# EAGLE board isolator_v2 (EAGLE 5.12), part 1 of 2
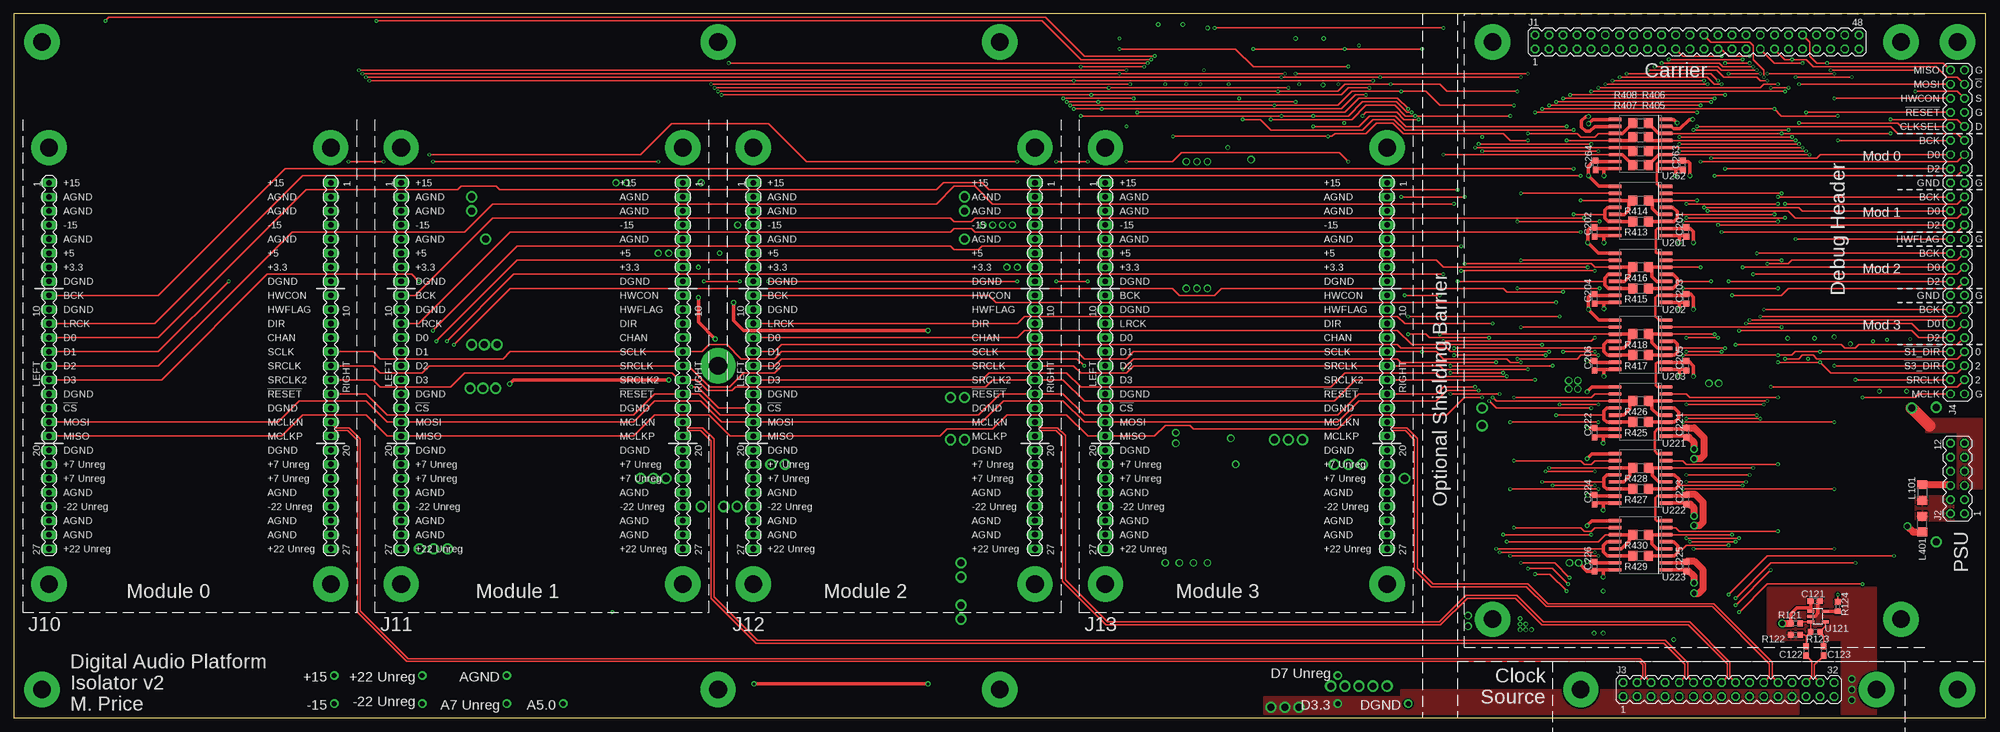
[diagram p7: board, top side]
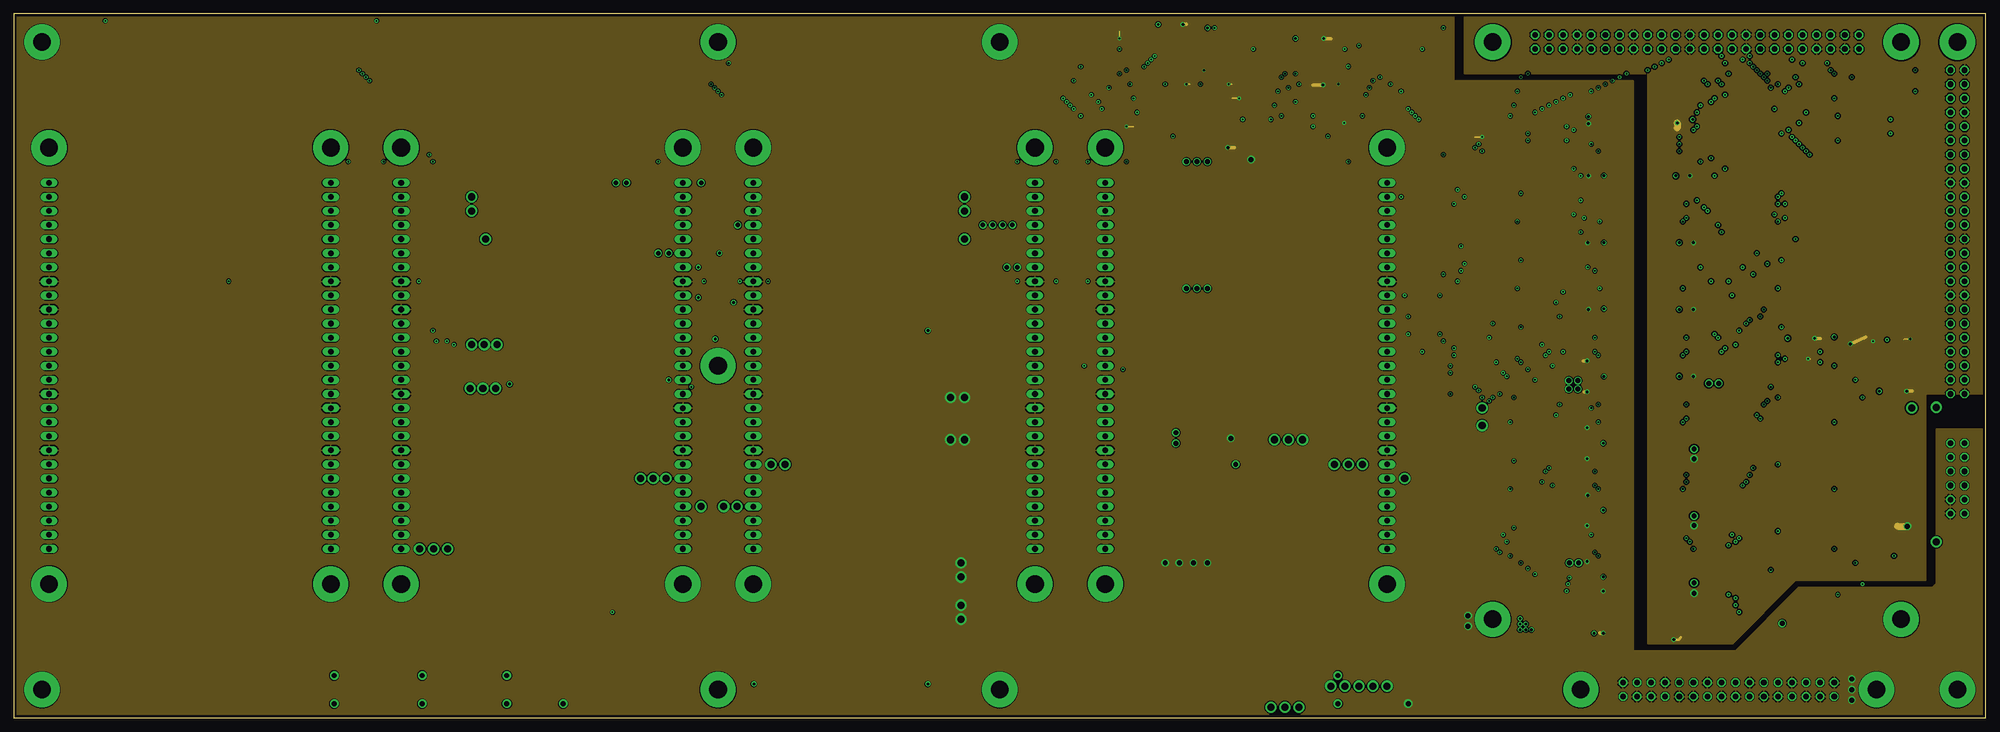
[diagram p8: board, inner layer Route2]
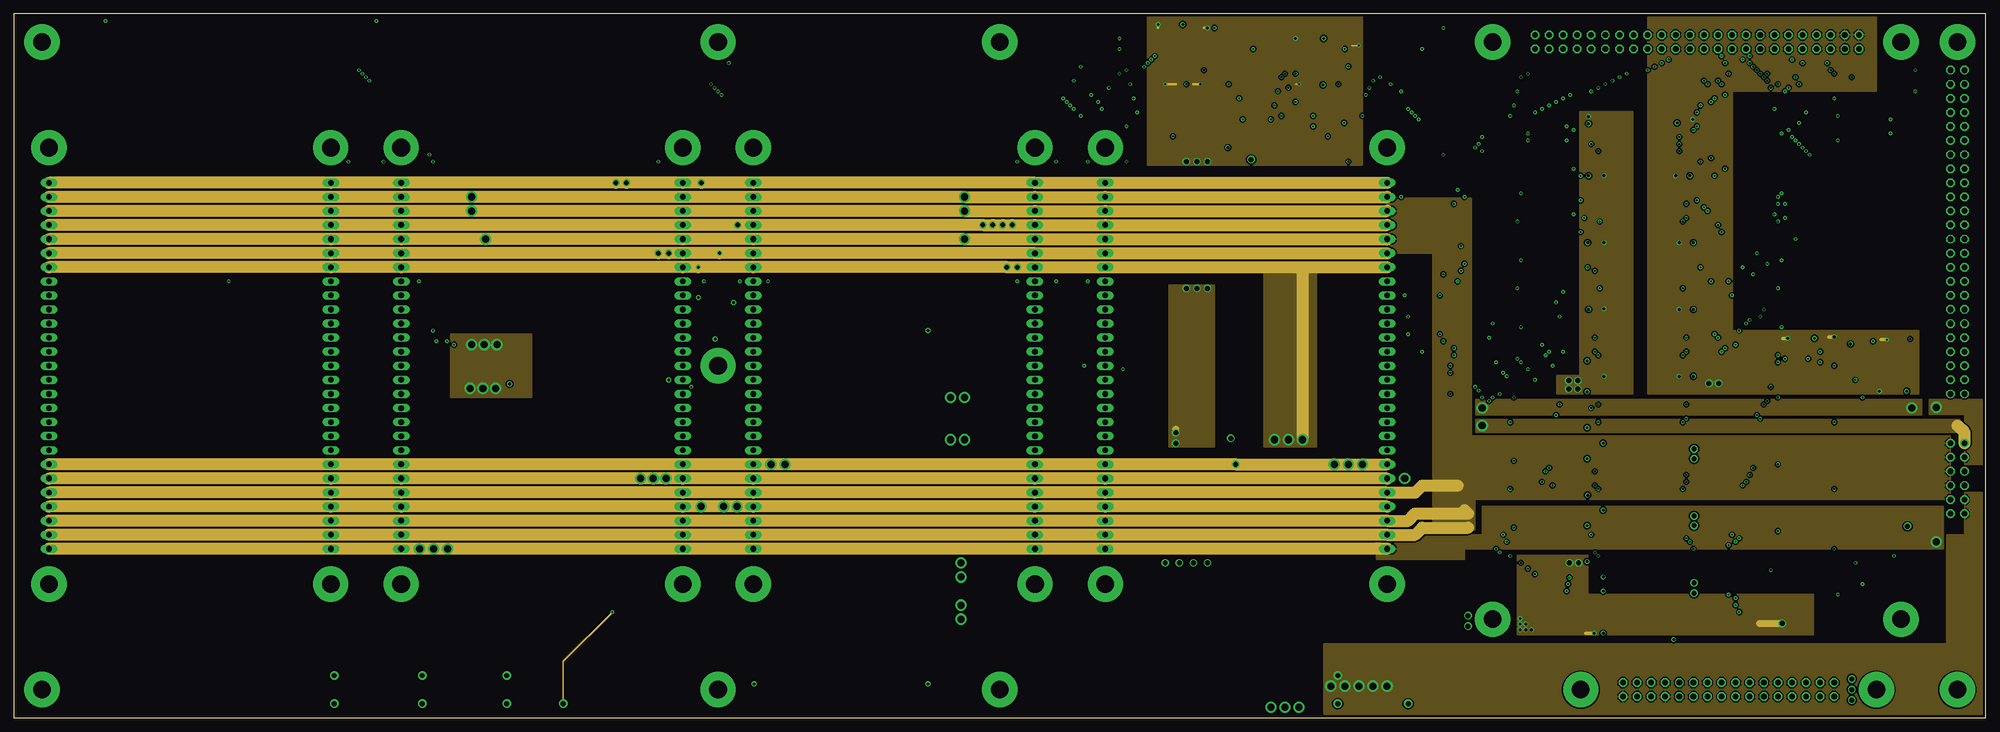
[diagram p9: board, inner layer Route15]
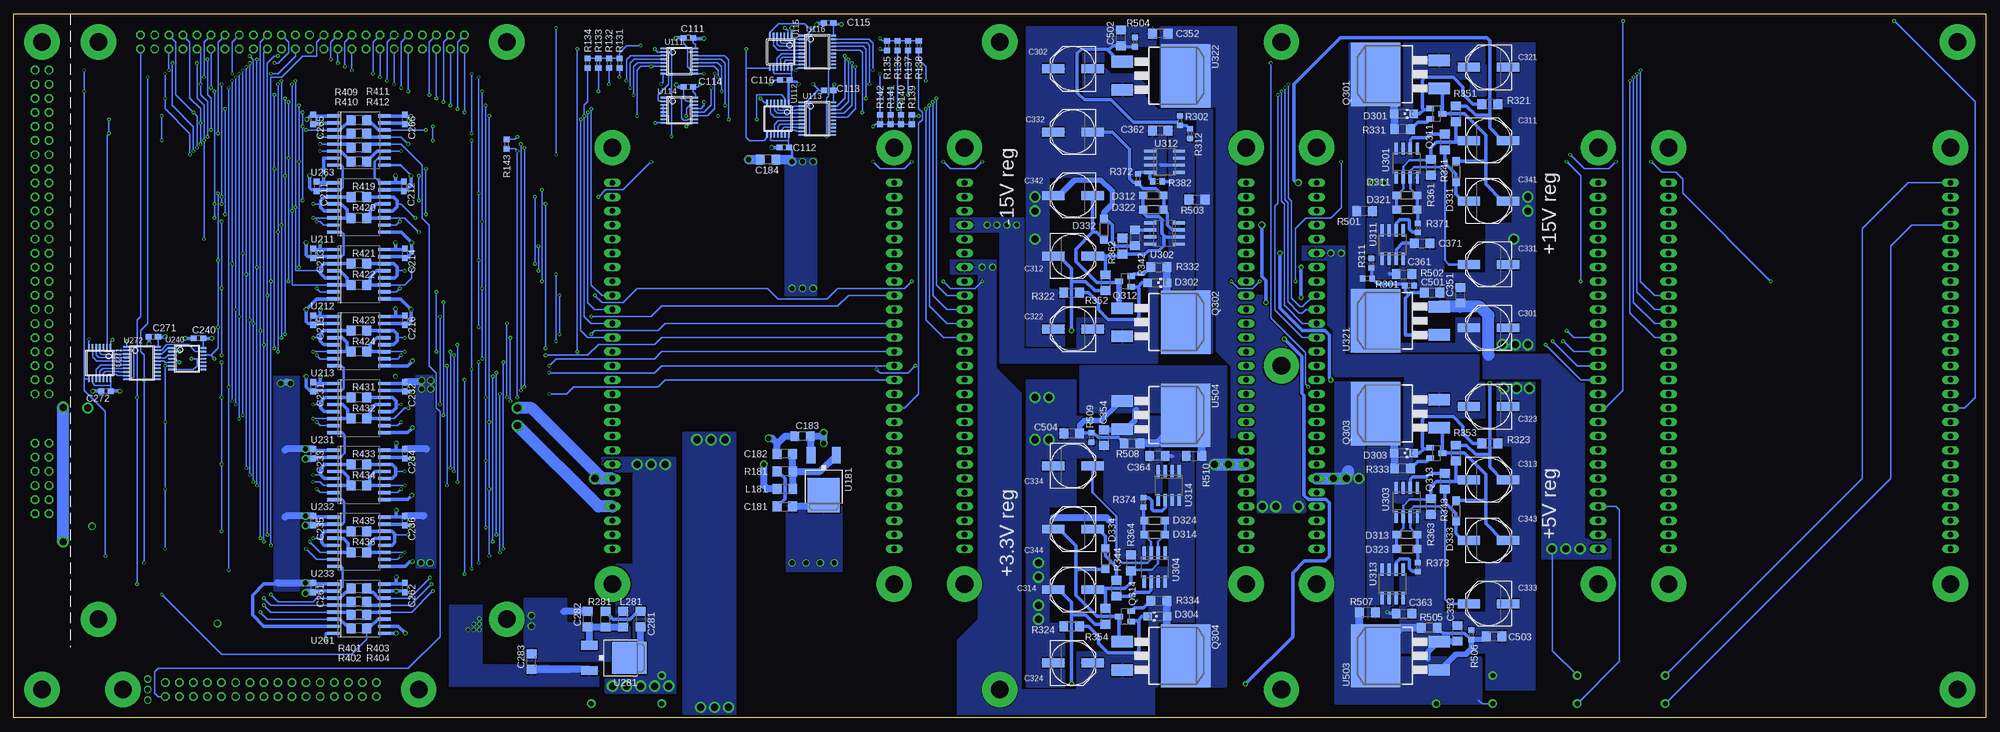
[diagram p10: board, bottom side, seen from below]

Size 355.6 x 127 mm. Coordinates in mm from the lower left corner, seen from the top.
Outline: 0,0 355.6,0 355.6,127 0,127 0,0
Copper layers (1*2*15*16): Top 0.035mm / dielectric 0.18mm / Route2 0.017mm / dielectric 1.12mm / Route15 0.017mm / dielectric 0.18mm / Bottom 0.035mm
Design rules "easyeda_4layer": minimum track width 6mil, minimum drill 12mil, track to track 6mil, track to pad 6mil, pad to pad 6mil, via to via 8mil, smd to smd 0mil, copper to edge 20mil, drill to drill 10mil, minimum pad ring 6mil, minimum via ring 6mil, stop-mask expansion 0mil, vias tented up to drill 100mil, thermal gap 10mil

## Footprints (pad centres in the part's own frame; a part is rotated, then mirrored left to right if it is on the bottom)
C0603 = smd 1.1 x 1: 1 -0.85,0; 2 0.85,0
C1206 = smd 1.6 x 1.8: 1 -1.4,0; 2 1.4,0
PANASONIC_F = smd 4 x 1.6: + 3.55,0; - -3.55,0
CHIPLED_1206 = smd 1.5 x 1.5: A 0,-1.75; C 0,1.75
SOD123 = smd 1.4 x 1.4: A 1.9,0; C -1.9,0
MA24-2 = drill 1.016 octagon: 1 -29.21,-1.27; 2 -29.21,1.27; 3 -26.67,-1.27; 4 -26.67,1.27; 5 -24.13,-1.27; 6 -24.13,1.27; 7 -21.59,-1.27; 8 -21.59,1.27; 9 -19.05,-1.27; 10 -19.05,1.27; 11 -16.51,-1.27; 12 -16.51,1.27; 13 -13.97,-1.27; 14 -13.97,1.27; 15 -11.43,-1.27; 16 -11.43,1.27; 17 -8.89,-1.27; 18 -8.89,1.27; 19 -6.35,-1.27; 20 -6.35,1.27; 21 -3.81,-1.27; 22 -3.81,1.27; 23 -1.27,-1.27; 24 -1.27,1.27; 25 1.27,-1.27; 26 1.27,1.27; 27 3.81,-1.27; 28 3.81,1.27; 29 6.35,-1.27; 30 6.35,1.27; 31 8.89,-1.27; 32 8.89,1.27; 33 11.43,-1.27; 34 11.43,1.27; 35 13.97,-1.27; 36 13.97,1.27; 37 16.51,-1.27; 38 16.51,1.27; 39 19.05,-1.27; 40 19.05,1.27; 41 21.59,-1.27; 42 21.59,1.27; 43 24.13,-1.27; 44 24.13,1.27; 45 26.67,-1.27; 46 26.67,1.27; 47 29.21,-1.27; 48 29.21,1.27 | drill 3.175 pad 6.35 round: DP1 -36.83,0; DP2 36.83,0; DP3 -36.83,-104.14; DP4 36.83,-104.14
MA06-2 = drill 1.016 octagon: 1 -6.35,-1.27; 2 -6.35,1.27; 3 -3.81,-1.27; 4 -3.81,1.27; 5 -1.27,-1.27; 6 -1.27,1.27; 7 1.27,-1.27; 8 1.27,1.27; 9 3.81,-1.27; 10 3.81,1.27; 11 6.35,-1.27; 12 6.35,1.27
MA16-2 = drill 1.016 octagon: 1 -20.32,-1.27; 2 -20.32,1.27; 3 -17.78,-1.27; 4 -17.78,1.27; 5 -15.24,-1.27; 6 -15.24,1.27; 7 -12.7,-1.27; 8 -12.7,1.27; 9 -10.16,-1.27; 10 -10.16,1.27; 11 -7.62,-1.27; 12 -7.62,1.27; 13 -5.08,-1.27; 14 -5.08,1.27; 15 -2.54,-1.27; 16 -2.54,1.27; 17 0,-1.27; 18 0,1.27; 19 2.54,-1.27; 20 2.54,1.27; 21 5.08,-1.27; 22 5.08,1.27; 23 7.62,-1.27; 24 7.62,1.27; 25 10.16,-1.27; 26 10.16,1.27; 27 12.7,-1.27; 28 12.7,1.27; 29 15.24,-1.27; 30 15.24,1.27; 31 17.78,-1.27; 32 17.78,1.27 | drill 3.175 pad 6.35 round: P$1 25.4,0; P$2 -27.94,0
MA24-2-HEADERONLY = drill 1.016 octagon: 1 -29.21,-1.27; 2 -29.21,1.27; 3 -26.67,-1.27; 4 -26.67,1.27; 5 -24.13,-1.27; 6 -24.13,1.27; 7 -21.59,-1.27; 8 -21.59,1.27; 9 -19.05,-1.27; 10 -19.05,1.27; 11 -16.51,-1.27; 12 -16.51,1.27; 13 -13.97,-1.27; 14 -13.97,1.27; 15 -11.43,-1.27; 16 -11.43,1.27; 17 -8.89,-1.27; 18 -8.89,1.27; 19 -6.35,-1.27; 20 -6.35,1.27; 21 -3.81,-1.27; 22 -3.81,1.27; 23 -1.27,-1.27; 24 -1.27,1.27; 25 1.27,-1.27; 26 1.27,1.27; 27 3.81,-1.27; 28 3.81,1.27; 29 6.35,-1.27; 30 6.35,1.27; 31 8.89,-1.27; 32 8.89,1.27; 33 11.43,-1.27; 34 11.43,1.27; 35 13.97,-1.27; 36 13.97,1.27; 37 16.51,-1.27; 38 16.51,1.27; 39 19.05,-1.27; 40 19.05,1.27; 41 21.59,-1.27; 42 21.59,1.27; 43 24.13,-1.27; 44 24.13,1.27; 45 26.67,-1.27; 46 26.67,1.27; 47 29.21,-1.27; 48 29.21,1.27
MOD-V2 = drill 1.016 long: 1L -25.4,33.02; 1R 25.4,33.02; 2L -25.4,30.48; 2R 25.4,30.48; 3L -25.4,27.94; 3R 25.4,27.94; 4L -25.4,25.4; 4R 25.4,25.4; 5L -25.4,22.86; 5R 25.4,22.86; 6L -25.4,20.32; 6R 25.4,20.32; 7L -25.4,17.78; 7R 25.4,17.78; 8L -25.4,15.24; 8R 25.4,15.24; 9L -25.4,12.7; 9R 25.4,12.7; 10L -25.4,10.16; 10R 25.4,10.16; 11L -25.4,7.62; 11R 25.4,7.62; 12L -25.4,5.08; 12R 25.4,5.08; 13L -25.4,2.54; 13R 25.4,2.54; 14L -25.4,0; 14R 25.4,0; 15L -25.4,-2.54; 15R 25.4,-2.54; 16L -25.4,-5.08; 16R 25.4,-5.08; 17L -25.4,-7.62; 17R 25.4,-7.62; 18L -25.4,-10.16; 18R 25.4,-10.16; 19L -25.4,-12.7; 19R 25.4,-12.7; 20L -25.4,-15.24; 20R 25.4,-15.24; 21L -25.4,-17.78; 21R 25.4,-17.78; 22L -25.4,-20.32; 22R 25.4,-20.32; 23L -25.4,-22.86; 23R 25.4,-22.86; 24L -25.4,-25.4; 24R 25.4,-25.4; 25L -25.4,-27.94; 25R 25.4,-27.94; 26L -25.4,-30.48; 26R 25.4,-30.48; 27L -25.4,-33.02; 27R 25.4,-33.02 | drill 3.175 pad 6.35 round: DP1 -25.4,39.37; DP2 25.4,39.37; DP3 -25.4,-39.37; DP4 25.4,-39.37
R1206 = smd 1.6 x 1.803: 1 -1.422,0; 2 1.422,0
D2PACK = smd 2.083 x 3.81: 1 -2.54,-8.89; 3 2.54,-8.89 | smd 11.43 x 8.89: 2 0,2.54
SOT23-BEC = smd 1 x 1.4: B -0.95,-1.1; C 0,1.1; E 0.95,-1.1
R0603 = smd 1 x 1.1: 1 -0.85,0; 2 0.85,0
TSSOP16 = smd 0.305 x 0.991: 1 -2.275,-2.918; 2 -1.625,-2.918; 3 -0.975,-2.918; 4 -0.325,-2.918; 5 0.325,-2.918; 6 0.975,-2.918; 7 1.625,-2.918; 8 2.275,-2.918; 9 2.275,2.918; 10 1.625,2.918; 11 0.975,2.918; 12 0.325,2.918; 13 -0.325,2.918; 14 -0.975,2.918; 15 -1.625,2.918; 16 -2.275,2.918
TSSOP14 = smd 0.305 x 0.991: 1 -1.95,-2.918; 2 -1.3,-2.918; 3 -0.65,-2.918; 4 0,-2.918; 5 0.65,-2.918; 6 1.3,-2.918; 7 1.95,-2.918; 8 1.95,2.918; 9 1.3,2.918; 10 0.65,2.918; 11 0,2.918; 12 -0.65,2.918; 13 -1.3,2.918; 14 -1.95,2.918
TSSOP20 = smd 0.305 x 0.991: 1 -2.925,-2.918; 2 -2.275,-2.918; 3 -1.625,-2.918; 4 -0.975,-2.918; 5 -0.325,-2.918; 6 0.325,-2.918; 7 0.975,-2.918; 8 1.625,-2.918; 9 2.275,-2.918; 10 2.925,-2.918; 11 2.925,2.918; 12 2.275,2.918; 13 1.625,2.918; 14 0.975,2.918; 15 0.325,2.918; 16 -0.325,2.918; 17 -0.975,2.918; 18 -1.625,2.918; 19 -2.275,2.918; 20 -2.925,2.918
SOT23-DBV = smd 0.55 x 1.2: 1 -0.95,-1.3; 2 0,-1.3; 3 0.95,-1.3; 4 0.95,1.3; 5 -0.95,1.3
DPACK = smd 1.6 x 3: 1 -2.28,-4.8; 3 2.28,-4.8 | smd 5.8 x 6.2: 4 0,2.38
SO-16W = smd 0.6 x 2.2: 1 -4.445,-4.6; 2 -3.175,-4.6; 3 -1.905,-4.6; 4 -0.635,-4.6; 5 0.635,-4.6; 6 1.905,-4.6; 7 3.175,-4.6; 8 4.445,-4.6; 9 4.445,4.6; 10 3.175,4.6; 11 1.905,4.6; 12 0.635,4.6; 13 -0.635,4.6; 14 -1.905,4.6; 15 -3.175,4.6; 16 -4.445,4.6
SO8 = smd 0.6 x 2.2: 1 -1.905,-2.6; 2 -0.635,-2.6; 3 0.635,-2.6; 4 1.905,-2.6; 5 1.905,2.6; 6 0.635,2.6; 7 -0.635,2.6; 8 -1.905,2.6
SOIC8 = smd 0.6 x 2.2: 1 -1.905,-2.6; 2 -0.635,-2.6; 3 0.635,-2.6; 4 1.905,-2.6; 5 1.905,2.6; 6 0.635,2.6; 7 -0.635,2.6; 8 -1.905,2.6

## Placement (x,y rotation side)
C111  0.1u  [C0603]  233.93,122.68 180 bottom
C112  0.1u  [C0603]  216.66,102.87 180 bottom
C113  0.1u  [C0603]  208.66,113.16 180 bottom
C114  0.1u  [C0603]  233.93,113.79 180 bottom
C115  0.1u  [C0603]  208.66,125.35 180 bottom
C116  0.1u  [C0603]  216.53,115.06 180 bottom
C121  0.1u  [C0603]  324.87,21.08 0 top
C122  10n  [C0603]  323.21,12.06 270 top
C123  10n  [C0603]  326.39,12.06 270 top
C181  10u  [C1206]  216.53,38.1 0 bottom
C182  1u  [C1206]  216.53,47.62 180 bottom
C183  1u  [C1206]  213.36,50.8 180 bottom
C184  10u  [C1206]  219.58,100.71 180 bottom
C201  0.1u  [C0603]  301.62,87.63 90 top
C202  0.1u  [C0603]  285.12,87.63 90 top
C203  0.1u  [C0603]  301.62,75.56 90 top
C204  0.1u  [C0603]  285.12,75.56 90 top
C205  0.1u  [C0603]  301.62,63.5 90 top
C206  0.1u  [C0603]  285.12,63.5 90 top
C211  0.1u  [C0603]  300.99,95.89 270 bottom
C212  0.1u  [C0603]  285.24,95.89 270 bottom
C213  0.1u  [C0603]  301.62,83.82 270 bottom
C214  0.1u  [C0603]  285.12,83.82 270 bottom
C215  0.1u  [C0603]  301.62,71.75 270 bottom
C216  0.1u  [C0603]  285.12,71.75 270 bottom
C221  0.1u  [C0603]  301.62,51.44 90 top
C222  0.1u  [C0603]  285.12,51.44 90 top
C223  0.1u  [C0603]  301.62,39.37 90 top
C224  0.1u  [C0603]  285.12,39.37 90 top
C225  0.1u  [C0603]  301.62,27.3 90 top
C226  0.1u  [C0603]  285.12,27.3 90 top
C231  0.1u  [C0603]  301.62,59.69 270 bottom
C232  0.1u  [C0603]  285.12,59.69 270 bottom
C233  0.1u  [C0603]  301.62,47.62 270 bottom
C234  0.1u  [C0603]  285.12,47.62 270 bottom
C235  0.1u  [C0603]  301.62,35.56 270 bottom
C236  0.1u  [C0603]  285.12,35.56 270 bottom
C240  0.1u  [C0603]  322.33,68.45 180 bottom
C261  0.1u  [C0603]  301.62,23.5 270 bottom
C262  0.1u  [C0603]  285.12,23.5 270 bottom
C263  0.1u  [C0603]  300.99,99.69 90 top
C264  0.1u  [C0603]  285.24,99.69 90 top
C265  0.1u  [C0603]  301.62,107.95 270 bottom
C266  0.1u  [C0603]  285.12,107.95 270 bottom
C271  0.1u  [C0603]  330.45,68.71 180 bottom
C272  0.1u  [C0603]  338.96,58.93 180 bottom
C281  10u  [C1206]  242.57,17.78 270 bottom
C282  1u  [C1206]  252.09,17.78 90 bottom
C283  10u  [C1206]  262.25,10.16 90 bottom
C301  100u  [PANASONIC_F]  89.66,70.36 180 bottom
C302  100u  [PANASONIC_F]  164.59,117.09 180 bottom
C311  100u  [PANASONIC_F]  89.66,104.14 0 bottom
C312  100u  [PANASONIC_F]  164.59,83.31 0 bottom
C313  100u  [PANASONIC_F]  89.66,42.93 0 bottom
C314  100u  [PANASONIC_F]  164.59,23.11 180 bottom
C321  100u  [PANASONIC_F]  89.66,117.35 180 bottom
C322  100u  [PANASONIC_F]  164.59,70.1 180 bottom
C323  100u  [PANASONIC_F]  89.66,56.13 180 bottom
C324  100u  [PANASONIC_F]  164.59,9.91 0 bottom
C331  100u  [PANASONIC_F]  89.66,81.79 180 bottom
C332  100u  [PANASONIC_F]  164.59,105.66 180 bottom
C333  100u  [PANASONIC_F]  89.66,20.57 180 bottom
C334  100u  [PANASONIC_F]  164.59,45.47 0 bottom
C341  100u  [PANASONIC_F]  89.66,93.22 0 bottom
C342  100u  [PANASONIC_F]  164.59,94.23 180 bottom
C343  100u  [PANASONIC_F]  89.66,32 0 bottom
C344  100u  [PANASONIC_F]  164.59,34.04 180 bottom
C351  1u  [C1206]  94.74,76.2 90 bottom
C352  1u  [C1206]  148.84,123.44 180 bottom
C353  1u  [C1206]  95.25,15.24 90 bottom
C354  1u  [C1206]  159,50.55 270 bottom
C361  1u  [C1206]  104.9,80.01 0 bottom
C362  1u  [C1206]  148.84,105.92 180 bottom
C363  1u  [C1206]  104.9,18.8 0 bottom
C364  1u  [C1206]  149.35,47.24 180 bottom
C371  1u  [C1206]  101.6,85.6 0 bottom
C501  10u  [C1206]  99.82,76.71 0 bottom
C502  10u  [C1206]  155.96,122.68 90 bottom
C503  10u  [C1206]  88.65,14.73 0 bottom
C504  10u  [C1206]  164.85,51.31 180 bottom
D301  Green  [CHIPLED_1206]  104.9,108.97 270 bottom
D302  Green  [CHIPLED_1206]  149.35,78.49 270 bottom
D303  Green  [CHIPLED_1206]  104.9,47.75 270 bottom
D304  Green  [CHIPLED_1206]  149.35,18.29 90 bottom
D311  1N4148_SMD  [SOD123]  104.39,94.23 0 bottom
D312  1N4148_SMD  [SOD123]  150.11,94.23 0 bottom
D313  1N4148_SMD  [SOD123]  104.39,33.02 0 bottom
D314  1N4148_SMD  [SOD123]  149.86,33.02 180 bottom
D321  1N4148_SMD  [SOD123]  104.39,91.69 180 bottom
D322  1N4148_SMD  [SOD123]  150.11,91.69 180 bottom
D323  1N4148_SMD  [SOD123]  104.39,30.48 180 bottom
D324  1N4148_SMD  [SOD123]  149.86,35.56 0 bottom
D331  MMSZ5235B  [SOD123]  95.5,98.55 270 bottom
D332  MMSZ5235B  [SOD123]  159,88.14 270 bottom
D333  MMSZ5226B  [SOD123]  95.5,37.34 270 bottom
D334  MMSZ5226B  [SOD123]  158.75,28.7 90 bottom
J1  CARRIER-V2  [MA24-2]  303.53,121.92 0 top
J2  PSU-V2  [MA06-2]  350.52,43.18 90 top
J3  CLKBRD-V2  [MA16-2]  310.51,5.08 0 top
J4  MA24-2  [MA24-2-HEADERONLY]  350.52,87.63 90 top
J10  MOD-V2  [MOD-V2]  31.75,63.5 0 top
J11  MOD-V2  [MOD-V2]  95.25,63.5 0 top
J12  MOD-V2  [MOD-V2]  158.75,63.5 0 top
J13  MOD-V2  [MOD-V2]  222.25,63.5 0 top
L101  BEAD  [R1206]  344.17,40.64 90 top
L181  BEAD  [R1206]  216.53,41.27 0 bottom
L281  BEAD  [R1206]  245.75,17.78 270 bottom
L401  BEAD  [R1206]  344.17,34.92 270 top
Q301  D44H11  [D2PACK]  107.44,116.08 90 bottom
Q302  D45H11  [D2PACK]  146.81,71.37 270 bottom
Q303  D44H11  [D2PACK]  107.44,54.86 90 bottom
Q304  D44H11  [D2PACK]  146.81,11.18 270 bottom
Q311  BC807-25SMD  [SOT23-BEC]  99.06,108.97 270 bottom
Q312  BC817-25SMD  [SOT23-BEC]  155.19,78.74 90 bottom
Q313  BC807-25SMD  [SOT23-BEC]  99.06,47.75 270 bottom
Q314  BC807-25SMD  [SOT23-BEC]  155.19,18.29 90 bottom
R121  10k  [R0603]  321.31,17.02 180 top
R122  10k  [R0603]  321.31,14.99 0 top
R123  100  [R0603]  324.87,15.49 180 top
R124  22  [R0603]  328.93,20.07 270 top
R131  10k  [R0603]  246.38,118.11 90 bottom
R132  10k  [R0603]  248.28,118.11 90 bottom
R133  10k  [R0603]  250.19,118.11 90 bottom
R134  10k  [R0603]  252.09,118.11 90 bottom
R135  10k  [R0603]  198.12,121.28 270 bottom
R136  10k  [R0603]  196.22,121.28 270 bottom
R137  10k  [R0603]  194.31,121.28 270 bottom
R138  10k  [R0603]  192.41,121.28 270 bottom
R139  10k  [R0603]  193.68,107.95 90 bottom
R140  10k  [R0603]  195.58,107.95 90 bottom
R141  10k  [R0603]  197.49,107.95 90 bottom
R142  10k  [R0603]  199.39,107.95 90 bottom
R143  10k  [R0603]  266.7,103.5 270 bottom
R181  1  [R1206]  216.53,44.45 0 bottom
R281  1  [R1206]  248.92,17.78 270 bottom
R301  1k  [R0603]  111.51,79.25 0 bottom
R302  1k  [R0603]  145.29,107.7 270 bottom
R311  825  [R0603]  110.74,82.04 90 bottom
R312  825  [R0603]  143.51,105.41 270 bottom
R321  10k  [R1206]  89.41,110.74 0 bottom
R322  10k  [R1206]  164.85,76.71 180 bottom
R323  10k  [R1206]  89.41,49.53 0 bottom
R324  10k  [R1206]  164.85,16.51 180 bottom
R331  68.1  [R1206]  105.16,106.17 0 bottom
R332  68.1  [R1206]  149.1,81.28 180 bottom
R333  68.1  [R1206]  105.16,44.96 0 bottom
R334  68.1  [R1206]  149.1,21.08 180 bottom
R341  10  [R1206]  97.54,103.89 90 bottom
R342  10  [R1206]  153.42,86.61 90 bottom
R343  10  [R1206]  97.54,42.67 90 bottom
R344  10  [R1206]  156.72,23.37 270 bottom
R351  3.01k  [R1206]  95.5,108.97 270 bottom
R352  750  [R1206]  158.75,78.49 90 bottom
R353  1k  [R1206]  95.5,47.75 270 bottom
R354  649  [R1206]  158.75,18.29 90 bottom
R361  604  [R1206]  100.08,99.31 270 bottom
R362  1.50k  [R1206]  155.7,85.09 90 bottom
R363  1k  [R1206]  100.08,38.1 270 bottom
R364  2.0k  [R1206]  154.18,27.94 90 bottom
R371  499  [R0603]  102.36,88.39 270 bottom
R372  499  [R0603]  152.91,97.28 90 bottom
R373  499  [R0603]  102.36,27.18 270 bottom
R374  499  [R0603]  151.89,38.86 90 bottom
R382  1k  [R0603]  149.35,96.77 0 bottom
R401  0  [R1206]  293.37,23.37 0 bottom
R402  0  [R1206]  293.37,20.95 0 bottom
R403  0  [R1206]  293.37,18.54 0 bottom
R404  0  [R1206]  293.37,16.13 0 bottom
R405  0  [R1206]  293.37,99.69 180 top
R406  0  [R1206]  293.37,102.23 180 top
R407  0  [R1206]  293.37,104.78 180 top
R408  0  [R1206]  293.37,107.31 180 top
R409  0  [R1206]  293.37,107.82 0 bottom
R410  0  [R1206]  293.37,105.41 0 bottom
R411  0  [R1206]  293.37,102.87 0 bottom
R412  0  [R1206]  293.37,100.33 0 bottom
R413  0  [R1206]  293.37,89.53 180 top
R414  0  [R1206]  293.37,93.34 180 top
R415  0  [R1206]  293.37,77.47 180 top
R416  0  [R1206]  293.37,81.28 180 top
R417  0  [R1206]  293.37,65.41 180 top
R418  0  [R1206]  293.37,69.22 180 top
R419  0  [R1206]  293.37,93.98 0 bottom
R420  0  [R1206]  293.37,90.17 0 bottom
R421  0  [R1206]  293.37,81.92 0 bottom
R422  0  [R1206]  293.37,78.11 0 bottom
R423  0  [R1206]  293.37,69.85 0 bottom
R424  0  [R1206]  293.37,66.04 0 bottom
R425  0  [R1206]  293.37,53.34 180 top
R426  0  [R1206]  293.37,57.15 180 top
R427  0  [R1206]  293.37,41.27 180 top
R428  0  [R1206]  293.37,45.09 180 top
R429  0  [R1206]  293.37,29.21 180 top
R430  0  [R1206]  293.37,33.02 180 top
R431  0  [R1206]  293.37,57.78 0 bottom
R432  0  [R1206]  293.37,53.98 0 bottom
R433  0  [R1206]  293.37,45.72 0 bottom
R434  0  [R1206]  293.37,41.91 0 bottom
R435  0  [R1206]  293.37,33.66 0 bottom
R436  0  [R1206]  293.37,29.84 0 bottom
R501  0  [R1206]  112.01,91.44 0 bottom
R502  2.21k  [R0603]  103.89,77.98 0 bottom
R503  0  [R1206]  142.24,93.47 180 bottom
R504  2.21k  [R0603]  153.42,121.92 90 bottom
R505  475  [R1206]  100.33,16.26 0 bottom
R506  1.42k  [R0603]  92.71,14.99 90 bottom
R507  0  [R1206]  111.51,19.05 0 bottom
R508  866  [R1206]  153.92,49.53 180 bottom
R509  1.42k  [R0603]  161.29,50.55 270 bottom
R510  0  [R1206]  142.75,47.24 180 bottom
U111  74165FT  [TSSOP16]  235.59,118.49 270 bottom
U112  74164FT  [TSSOP14]  217.81,108.08 180 bottom
U113  74LVTH574  [TSSOP20]  210.69,108.08 270 bottom
U114  74165FT  [TSSOP16]  235.59,109.6 270 bottom
U115  74164FT  [TSSOP14]  217.3,120.14 180 bottom
U116  74LVTH574  [TSSOP20]  210.69,120.14 270 bottom
U121  DS90LV012  [SOT23-DBV]  325.37,18.29 270 top
U181  78M33  [DPACK]  209.55,42.55 180 bottom
U201  ADUM3402  [SO-16W]  293.37,91.44 90 top
U202  ADUM3402  [SO-16W]  293.37,79.38 90 top
U203  ADUM3402  [SO-16W]  293.37,67.31 90 top
U211  ADUM3402  [SO-16W]  293.37,92.08 270 bottom
U212  ADUM3402  [SO-16W]  293.37,80.01 270 bottom
U213  ADUM3402  [SO-16W]  293.37,67.94 270 bottom
U221  ADUM3402  [SO-16W]  293.37,55.24 90 top
U222  ADUM3402  [SO-16W]  293.37,43.18 90 top
U223  ADUM3402  [SO-16W]  293.37,31.11 90 top
U231  ADUM3402  [SO-16W]  293.37,55.88 270 bottom
U232  ADUM3402  [SO-16W]  293.37,43.81 270 bottom
U233  ADUM3402  [SO-16W]  293.37,31.75 270 bottom
U240  7404MT  [TSSOP14]  324.36,64.77 270 bottom
U261  ADUM3401  [SO-16W]  293.37,19.68 270 bottom
U262  ADUM3402  [SO-16W]  293.37,103.5 90 top
U263  ADUM3401  [SO-16W]  293.37,104.14 270 bottom
U271  74164FT  [TSSOP14]  340.11,64.01 180 bottom
U272  74LVTH574  [TSSOP20]  332.49,64.01 270 bottom
U281  78M33  [DPACK]  247.01,10.79 270 bottom
U301  LME49710  [SO8]  104.39,100.08 0 bottom
U302  LME49710  [SO8]  148.08,87.38 90 bottom
U303  AD8655  [SO8]  104.39,38.86 0 bottom
U304  AD8655  [SO8]  149.86,27.18 180 bottom
U311  MAX6220  [SO8]  106.93,85.34 0 bottom
U312  LT1236S-10  [SOIC8]  148.08,100.33 270 bottom
U313  ADR4525  [SO8]  106.93,24.13 0 bottom
U314  ADR4525  [SO8]  147.32,41.91 180 bottom
U321  LM317BD2T  [D2PACK]  107.44,71.63 90 bottom
U322  LM337  [D2PACK]  146.81,115.82 270 bottom
U503  LM317BD2T  [D2PACK]  107.44,11.18 90 bottom
U504  LM317BD2T  [D2PACK]  146.81,54.61 270 bottom

## Tracks (layer width: path | path; a pad name or v marks a point on that pad's centre or on a via)
!CS  (via drill 0.3 pad 0.51)
  Top 0.254: v221.62,107.95 224.79,107.95 226.69,106.05 243.21,106.05 245.11,107.95 248.92,107.95 250.82,106.05 v281.31,106.05
  Bottom 0.254: U112.2 216.5,111.73 217.17,112.39 221.62,112.39 v221.62,107.95 | v281.31,106.05 289.56,106.05
  Bottom 0.61: U263.14 289.56,106.05 289.81,106.05 291.72,107.95 R409.2
!RESET  (via drill 0.3 pad 0.51)
  Top 0.254: J10.16R 63.5,58.42 67.31,54.61 111.76,54.61 115.57,58.42 J11.16R 123.57,58.42 127.38,54.61 173.99,54.61 177.8,58.42 J12.16R 189.23,58.42 193.04,54.61 238.76,54.61 242.57,58.42 J13.16R 256.54,58.42 257.81,59.69 v263.52,59.69 | v263.52,102.87 U262.13
  Top 0.61: U262.13 291.31,102.87 R406.2
  Bottom 0.254: v263.52,59.69 v263.52,102.87
A5V  (via drill 0.3 pad 0.51, 0.51 pad 0.89, 0.81 pad 1.27, 0.89 pad 1.52)
  Top 0.61: v89.41,60.2 90.17,60.96 v118.11,60.96
  Route15 0.254: v99.06,2.54 99.06,10.16 v107.95,19.05
  Route15 2.184: J13.6R J13.6L J12.6R J12.6L v127.25,83.82 J11.6R v118.11,83.82 v116.2,83.82 J11.6L J10.6R J10.6L
  Bottom 0.61: 107.57,18.92 107.44,18.8 C363.1 | C313.+ 87.12,42.93 89.41,45.21 89.41,47.24 | v89.41,60.2 89.41,47.24 | R353.1 93.62,49.17 91.95,47.5 89.66,47.5 89.41,47.24 | v118.11,60.96 118.36,61.21 118.36,69.09 119.13,69.85 123.19,69.85 127.25,73.91 v127.25,83.82
  pour Bottom: 106.68,18.03 111.51,18.03 111.51,48.77 104.9,48.77 104.9,60.45 103.38,60.45 103.38,38.86 106.93,38.86 106.93,20.07 106.68,20.07
  pour Bottom: 104.9,54.1 104.9,60.45 90.42,60.45 90.42,54.1
  pour Bottom: 91.44,60.33 91.44,65.41 115.57,65.41 115.57,85.09 123.19,85.09 123.19,82.55 118.62,82.55 118.62,70.87 117.6,69.85 117.6,61.98 117.22,61.59 104.78,61.59 104.78,60.33
A7VU  (via drill 0.89 pad 1.52, 1.27 pad 2.03)
  Top 2.184: v342.26,55.88 345.44,52.7
  Route15 2.184: J10.22L J10.22R J11.22L v113.03,43.18 v115.32,43.18 v117.6,43.18 J11.22R J12.22L J12.22R J13.22L J13.22R
  Bottom 0.254: v88.9,2.54 90.81,2.54 91.44,3.17
  Bottom 1.016: U503.3 98.43,13.84 C353.1 95.37,13.72 98.81,13.72 100.58,11.94 100.58,10.67
  Bottom 1.422: R333.1 106.58,47.75 D303.A 106.65,54.86 Q303.2
  Bottom 2.184: J11.22R v117.6,43.18 v115.32,43.18 114.94,44.45 | v264.8,55.88 262.25,55.88 249.56,43.18 J13.22R v250.82,43.18
  pour Bottom (no thermals): 117.35,60.45 117.35,2.54 90.93,2.54 90.93,10.92 112.01,10.92 112.01,60.45
  pour Bottom (no thermals): 105.66,60.58 117.35,60.58 117.35,59.44 105.66,59.44
  pour Top (isolate 0.254): 350.52,41.27 354.96,41.27 354.96,53.98 344.81,53.98 344.81,51.44 350.52,51.44
  pour Route15 (isolate 0.254): 263.65,57.4 344.04,57.4 344.04,54.61 263.65,54.61
AGND  (via drill 0.89 pad 1.52, 1.27 pad 2.03)
  Top 1.27: J2.6 349.1,42.06 L101.2
  Route15 2.184: J10.25L J10.25R J11.25L J11.25R J12.25L J12.25R J13.25L J13.25R 251.46,35.56 252.73,36.83 262.25,36.83 261.62,37.47 | J10.26L J10.26R J11.26L J11.26R J12.26L J12.26R J13.26L J13.26R 252.73,33.02 254,34.29 262.25,34.29 | J10.23L J10.23R J11.23L J11.23R J12.23L J12.23R J13.23L J13.23R 252.73,40.64 254,41.91 260.35,41.91 | J10.2L J10.2R J11.2L v82.55,93.98 J11.2R J12.2L v171.45,93.98 J12.2R J13.2L J13.2R | J13.3R J13.3L J12.3R v171.45,91.44 J12.3L J11.3R v82.55,91.44 J11.3L J10.3R J10.3L | J10.5L J10.5R J11.5L v85.09,86.36 J11.5R J12.5L v171.45,86.36 J12.5R J13.5L J13.5R
  Bottom 0.61: U311.4 105.03,83.31 | U312.6 148.72,99.69 148.84,99.82 | U313.4 105.03,22.1
  other vias: 82.55,67.31 84.84,67.31 87.12,67.31 82.3,59.44 84.58,59.44 86.87,59.44 88.9,7.62
  pour Bottom: 90.17,70.61 90.17,89.15 85.34,89.15 85.34,110.24 88.14,110.24 88.14,121.67 81.28,121.67 81.28,66.29 88.14,66.29 88.14,70.61
  pour Bottom: 105.66,98.55 105.66,96.27 102.62,96.27 102.62,86.61 105.66,86.61 105.66,75.69 97.79,75.69 89.41,72.64 84.07,68.58 84.07,80.26 97.79,80.26 97.79,98.55
  pour Bottom: 163.32,121.16 163.32,98.3 168.91,98.3 168.91,77.22 166.12,77.22 166.12,67.06 172.97,67.06 172.97,121.16
  pour Bottom: 156.46,97.79 147.83,97.79 147.83,107.19 153.92,107.19 157.99,111.25 164.08,111.25 170.18,118.87 170.18,105.41 156.46,105.41
  pour Bottom: 148.34,90.68 148.34,85.6 149.61,84.33 156.46,84.33 158.5,86.36 158.5,97.03 159,97.54 169.42,97.54 169.93,98.04 169.93,105.66 157.48,105.66 153.92,102.11
  pour Bottom: 90.17,5.08 90.17,27.94 85.34,27.94 85.34,49.02 88.14,49.02 88.14,60.45 81.28,60.45 81.28,5.08
  pour Bottom: 105.66,37.34 105.66,35.05 102.62,35.05 102.62,25.4 105.66,25.4 105.66,11.68 88.14,11.68 88.14,19.05 97.79,19.05 97.79,37.34
  pour Bottom: 149.61,124.71 172.97,124.71 172.97,121.16 149.61,121.16
  pour Route15 (isolate 0.254): 78.74,69.22 93.34,69.22 93.34,57.78 78.74,57.78
  pour Route15 (isolate 0.254): 255.91,93.73 262.89,93.73 262.89,50.8 349.25,50.8 349.25,39.37 263.52,39.37 263.52,33.91 255.91,33.91
  pour Route15 (isolate 0.254): 260.35,93.73 247.65,93.73 247.65,83.82 260.35,83.82
AN15V  (via drill 0.51 pad 0.89, 0.81 pad 1.27, 0.89 pad 1.52)
  Top 0.61: v164.85,69.85 131.57,69.85 129.79,71.63 v129.79,74.93
  Route15 2.184: J10.4L J10.4R J11.4L J11.4R v130.56,88.9 J12.4L v174.75,88.9 v176.53,88.9 v178.31,88.9 v180.09,88.9 J12.4R J13.4L J13.4R
  Bottom 0.254: v57.78,2.54 17.14,43.18 17.14,85.09 13.34,88.9 J10.4L
  Bottom 0.61: 167.13,83.31 164.85,81.03 164.85,78.99 | R352.1 160.63,77.06 162.31,78.74 164.59,78.74 164.85,78.99 | 146.81,96.77 R382.2 | v164.85,69.85 164.85,78.99 | v129.79,74.93 129.79,78.87 130.56,79.63 v130.56,88.9
  Bottom 1.016: 167.13,83.31 C312.-
  pour Bottom: 147.32,106.93 142.75,106.93 142.75,77.47 149.35,77.47 149.35,65.79 150.88,65.79 150.88,83.57 147.32,83.57
  pour Bottom: 149.35,72.14 149.35,65.79 163.83,65.79 163.83,72.14
  pour Bottom: 149.35,66.55 149.35,64.01 177.8,64.01 177.8,87.63 186.69,87.63 186.69,90.17 173.48,90.17 173.48,66.55
AN22VU  (via drill 0.89 pad 1.52, 1.27 pad 2.03)
  Route15 2.184: J10.24L J10.24R J11.24L J11.24R v123.95,38.1 v128.02,38.1 v130.43,38.1 J12.24L J12.24R J13.24L J13.24R | 350.52,52.7 351.79,51.44 J2.11
  Bottom 0.254: v73.66,2.54 66.04,10.16 66.04,37.47 66.67,38.1 J11.24L
  Bottom 2.184: J13.24R 250.19,38.1 v264.8,52.7
  pour Bottom (no thermals): 139.45,110.24 139.45,124.71 148.84,124.71 148.84,110.24
  pour Bottom (isolate 0.254): 140.97,124.71 135.13,124.71 135.13,76.2 122.68,76.2 122.68,37.08 131.32,37.08 131.32,50.55 136.02,50.55 136.02,63.5 138.68,66.17 138.68,110.24 140.97,110.24
  pour Route15 (isolate 0.254): 263.65,53.85 350.9,53.85 350.9,51.44 263.65,51.44
AP15V  (via drill 0.81 pad 1.27, 0.89 pad 1.52)
  Route15 2.184: J10.1L J10.1R J11.1L v108.58,96.52 v110.49,96.52 J11.1R v123.95,96.52 J12.1L J12.1R J13.1L J13.1R
  Bottom 0.254: v57.78,7.62 22.23,43.18 22.23,88.27 13.97,96.52 J10.1L
  Bottom 0.61: 107.57,80.14 107.44,80.01 C361.1 | C311.+ 87.12,104.14 89.41,106.43 89.41,108.46 | R351.1 93.62,110.39 91.95,108.71 89.66,108.71 89.41,108.46 | 89.41,108.46 89.41,122.17 89.92,122.68 116.33,122.68 124.71,114.3 124.71,97.03 123.95,96.27 v123.95,96.52
  pour Bottom: 106.68,79.25 111.51,79.25 111.51,109.98 104.9,109.98 104.9,121.67 103.38,121.67 103.38,100.08 106.93,100.08 106.93,81.28 106.68,81.28
  pour Bottom: 104.9,115.32 104.9,121.67 90.42,121.67 90.42,115.32
  pour Bottom: 90.17,112.27 90.17,117.86 92.96,117.86 92.96,112.27
AP22VU  (via drill 0.89 pad 1.52, 1.27 pad 2.03)
  Route15 2.184: J10.27L J10.27R J11.27L v73.15,30.48 v75.69,30.48 v78.23,30.48 J11.27R J12.27L J12.27R J13.27L J13.27R
  Bottom 0.254: v73.66,7.62 78.11,12.06 78.11,30.35 v78.23,30.48
  Bottom 1.422: 94.74,74.17 C351.1
  Bottom 2.184: U321.3 94.74,74.17 91.19,74.17 89.66,72.64 89.66,65.53 | v346.71,31.75 v346.71,56.01
  pour Bottom (isolate 0.381): 90.55,65.53 72.39,65.53 72.39,32.26 67.56,32.26 67.56,28.7 80.01,28.7 80.01,61.21 90.55,61.21
  pour Route15 (isolate 0.254): 345.44,57.4 354.96,57.4 354.96,45.72 351.79,45.72 351.79,54.74 345.44,54.74
  pour Route15 (isolate 0.254): 245.75,33.02 264.8,33.02 264.8,38.1 347.98,38.1 347.98,30.48 261.62,30.48 261.62,28.57 245.75,28.57
BASE
  Bottom 0.61: C341.+ 87.12,93.22 90.17,96.27 90.17,100.33 | 99.31,113.54 99.06,113.28 | 97.96,112.95 97.91,112.89 | 90.17,100.33 90.17,105.16 93.98,108.97 Q311.C 97.96,112.95 | D331.C 90.29,100.45 90.17,100.33 | 97.96,112.95 Q301.1
  Bottom 1.016: Q301.1 99.31,113.54
BASE1
  Bottom 0.61: C343.+ 87.12,32 90.17,35.05 90.17,39.12 | 99.31,52.32 99.06,52.07 | 97.91,51.68 Q303.1 97.96,51.73 Q313.C 93.98,47.75 90.17,43.94 90.17,39.12 | D333.C 90.29,39.24 90.17,39.12
  Bottom 1.016: Q303.1 99.31,52.32
BASE2
  Bottom 0.61: Q312.C 156.55,78.49 160.27,78.49 164.08,82.3 164.08,84.58 161.04,87.62 | C342.- 161.04,87.62 | D332.A 160.39,87.62 161.04,87.62
  Bottom 1.016: Q302.1 156.29,74.51 Q312.C
BASE3
  Bottom 0.61: C344.+ 167.13,34.04 164.08,30.99 164.08,26.92 | 154.94,13.72 155.19,13.97 | 156.35,14.36 Q304.1 155.96,13.46 156.21,13.46 156.29,13.55 Q314.C 160.27,18.29 164.08,22.1 164.08,26.92 | D334.C 163.96,26.8 164.08,26.92
  Bottom 1.016: Q304.1 154.94,13.72
C3V3  (via drill 0.3 pad 0.51, 0.51 pad 0.81, 0.89 pad 1.27)
  Top 0.61: 299.72,99.06 U262.1 | 299.72,99.06 300.9,99.06 C263.1 | 300.36,87 U201.1 | 300.36,87 301.41,87 C201.1 | 300.36,74.93 U202.1 | 300.36,74.93 301.41,74.93 C203.1 | 300.36,62.87 U203.1 | 300.36,62.87 301.41,62.87 C205.1 | U221.1 301.41,50.8 C221.1 | U222.1 301.41,38.73 C223.1 | U223.1 301.41,26.67 C225.1 | v300.36,61.59 300.36,62.87 | v300.36,85.72 300.36,87 | v299.72,97.79 299.72,99.06 | v300.36,73.66 300.36,74.93 | U262.7 298.96,106.68 299.34,106.3 300.48,106.3 302.13,107.95 v302.77,107.95
  Top 1.27: v303.02,48.48 303.02,49.66 302.09,50.59 C221.1 | v303.02,36.41 303.02,37.85 302.35,38.52 C223.1 | C225.1 302.06,26.45 302.89,25.65 303.02,25.53 v303.02,24.34
  Route15 0.61: v319.91,68.45 319.02,68.45 | v328.3,68.71 327.28,68.71 | 336.8,68.2 v337.82,68.2
  Bottom 0.254: U240.14 321.44,68.42 C240.1 | U271.9 341.41,60.35 341,59.94 338.11,59.94 | U271.1 338.16,67.86 v337.82,68.2
  Bottom 0.305: U272.20 329.6,66.97 C271.1 | U271.14 338.11,61.05 338.11,59.94 C272.1
  Bottom 0.61: U263.1 301.41,108.58 C265.1 301.92,108.8 v302.77,107.95 | U211.1 299.72,96.52 | 299.72,96.52 300.77,96.52 C211.1 | U212.1 300.36,84.45 | 300.36,84.45 301.41,84.45 C213.1 | U213.1 300.36,72.39 | 300.36,72.39 301.41,72.39 C215.1 | U231.1 300.36,60.33 | 300.36,60.33 301.41,60.33 C231.1 | U232.1 301.41,48.26 C233.1 | U233.1 301.41,36.2 C235.1 | U261.1 301.41,24.13 C261.1 | U261.7 310.51,16.51 312.55,18.54 312.55,22.1 310.51,24.13 307.34,24.13 308.1,24.34 | v303.02,24.34 303.06,24.34 | v319.91,68.45 C240.1 | C271.1 v328.3,68.71 | v336.42,58.93 C272.1 | 300.36,60.33 v300.36,61.59 | 300.36,84.45 v300.36,85.72 | 299.72,96.52 v299.72,97.79 299.72,100.97 U263.7 | 300.36,72.39 v300.36,73.66
  Bottom 1.27: C261.1 v303.02,24.34 308.1,24.34 | C235.1 v303.02,36.41 306.49,36.41 306.7,36.2 | C233.1 v303.02,48.48 306.49,48.48 306.7,48.26 | v305.69,60.33 306.49,60.54
  other vias: 307.47,60.33
  pour Route15 (isolate 0.254): 335.92,127 335.92,113.03 309.88,113.03 309.88,69.85 343.54,69.85 343.54,58.42 294.64,58.42 294.64,127
  pour Bottom (isolate 0.254): 304.17,61.59 304.17,22.86 308.61,22.86 308.61,61.59
C!CS  (via drill 0.3 pad 0.51)
  Top 0.254: J1.35 319.4,118.75 v320.68,118.75 323.21,118.75 324.49,117.47 346.71,117.47 348.62,115.57 350.52,115.57 J4.45 | v302.89,106.05 v320.04,106.05
  Bottom 0.254: v320.68,118.75 320.68,112.39 320.04,111.76 v320.04,106.05 | U263.3 v302.89,106.05
  Bottom 0.61: U263.3 296.8,106.05 294.89,107.95 R409.1
C!RESET  (via drill 0.3 pad 0.51)
  Top 0.254: 297.18,102.87 v322.58,102.87 | v323.21,109.22 J4.42
  Top 0.61: U262.4 297.18,102.87 295.43,102.87 R406.1
  Bottom 0.254: J1.44 326.39,121.92 326.39,112.39 323.85,109.86 v323.21,109.22 322.58,108.58 v322.58,102.87
C!S0_DIR  (via drill 0.3 pad 0.51)
  Top 0.254: v318.77,94.61 U201.7 | v318.77,82.55 U202.7 | U203.7 v318.77,70.48 | J4.7 350.52,64.77 325.12,64.77 324.49,65.41 322.58,65.41 321.94,64.77 v319.4,64.77
  Bottom 0.254: 320.02,65.42 U240.12 | v318.77,94.61 v318.77,82.55 v318.77,70.48 318.77,66.67 320.02,65.42 | v319.4,64.77 320.02,65.39 320.02,65.42
C!S1_DIR  (via drill 0.3 pad 0.51)
  Top 0.254: v318.13,89.53 v300.99,89.53 | v318.13,77.47 v300.99,77.47 | v300.99,65.41 v318.13,65.41 320.68,65.41 321.31,66.04 v325.75,66.04 J4.8
  Bottom 0.254: U240.2 326.42,66.07 v325.75,66.04 | v318.13,89.53 v318.13,77.47 v318.13,65.41 | v300.99,89.53 300.36,89.53 299.72,88.9 U211.7 297.18,88.9 | U212.7 300.36,76.83 v300.99,77.47 | U213.7 300.36,64.77 v300.99,65.41
C!S2_DIR  (via drill 0.3 pad 0.51)
  Top 0.254: v318.13,64.14 v325.75,64.14 327.66,62.23 350.52,62.23 J4.5 | v318.13,33.66 300.36,33.66 299.72,34.29 U223.7 | U222.7 300.99,46.35 301.62,45.72 v318.13,45.72 | U221.7 301.62,58.42 302.26,57.78 v318.13,57.78
  Bottom 0.254: U240.4 326.39,64.77 v325.75,64.14 | v318.13,33.66 v318.13,45.72 v318.13,57.78 v318.13,64.14
C!S3_DIR  (via drill 0.3 pad 0.51)
  Top 0.254: v302.89,30.48 v328.3,30.48 | v328.3,41.27 v300.99,41.27 | v328.3,53.34 v300.99,53.34 | v328.3,63.5 J4.6
  Bottom 0.254: U240.6 328.26,63.47 v328.3,63.5 328.3,62.87 v328.3,53.34 v328.3,41.27 v328.3,30.48 | v302.89,30.48 300.99,28.57 U233.7 | U232.7 300.36,40.64 v300.99,41.27 | U231.7 300.36,52.7 v300.99,53.34
CCLKSEL  (via drill 0.3 pad 0.51)
  Top 0.254: v300.36,103.5 v321.94,103.5 | J4.40 340.36,106.68 339.73,107.31 v321.94,107.31
  Bottom 0.254: J1.42 323.85,121.92 323.85,111.76 321.94,109.86 321.94,108.58 v321.94,107.31 v321.94,103.5 | U263.5 v300.36,103.5
  Bottom 0.61: U263.5 295.43,103.5 R411.1
CDIRCHAN  (via drill 0.3 pad 0.51)
  Top 0.254: U262.6 v318.77,105.41 v338.45,105.41 | J4.39 350.52,107.95 v338.45,107.95
  Top 0.61: U262.6 296.7,105.41 R408.1
  Bottom 0.254: J1.36 318.77,121.92 v318.77,105.41 | U271.2 338.81,105.06 v338.45,105.41 v338.45,107.95
CGND  (via drill 0.3 pad 0.51, 0.51 pad 0.81, 0.89 pad 1.27)
  Top 0.406: U262.2 296.67,100.33 296.29,99.95 296.29,96.27 296.67,95.89 U201.8 | U202.8 296.29,83.82 296.16,83.95 296.16,88.01 296.42,88.27 U201.2 | U203.8 296.67,71.75 296.04,72.39 296.04,75.82 296.42,76.2 U202.2 | U221.8 296.42,59.69 296.16,59.94 296.16,63.88 296.42,64.14 U203.2 | U222.8 296.42,47.62 295.91,48.13 295.91,51.56 296.42,52.07 U221.2 | U223.8 296.29,35.56 296.04,35.81 296.04,39.62 296.42,40.01 U222.2 | 301.62,28.19 C225.2 | 301.62,40.26 C223.2 | C221.2 301.62,52.32
  Top 0.61: 300.9,100.33 U262.2 | 300.9,100.33 C263.2 | 301.41,88.27 U201.2 | 301.41,88.27 C201.2 | U202.2 301.41,76.2 C203.2 302.43,76.42 302.89,75.95 v302.89,73.66 | U203.2 301.41,64.14 C205.2 302.05,64.35 302.89,63.5 v302.89,61.59 | U221.2 301.41,52.07 C221.2 | U222.2 301.41,40.01 C223.2 | U223.2 301.41,27.94 C225.2 | v302.26,97.79 302.26,100.08 302.01,100.33 300.9,100.33 | 301.41,88.27 302.39,88.27 302.89,87.76 v302.89,85.72 | U262.8 299.34,107.95 v299.97,107.31
  Top 1.27: L401.2 342.54,33.5 v341.5,34.54 | 301.62,52.32 303.02,52.32 304.8,50.55 304.8,47.37 304.17,46.74 v303.02,46.74 | 301.62,40.26 303.28,40.26 304.67,38.86 304.67,35.31 304.04,34.67 v303.02,34.67 | 301.62,28.19 303.15,28.19 304.67,26.67 304.67,23.24 303.91,22.48 v303.02,22.48
  Route2 0.254: v342.01,68.33 341,68.33 340.87,68.2 | v323.6,64.77 323.98,64.77
  Route2 0.406: v299.34,14.1 300.23,14.1 300.61,14.48
  Route2 0.61: v324.74,68.45 325.75,68.45 | v331.22,67.44 334.01,68.71 | v341.38,58.93 342.39,58.93
  Route2 1.27: 339.73,34.54 v341.5,34.54 | v299.97,107.31 299.97,106.43
  Bottom 0.254: 322.58,63.5 322.58,64.77 | 322.58,63.5 321.47,63.5 U240.9 | U240.7 323.26,62.82 322.58,63.5 | U271.7 342.06,68.28 v342.01,68.33 | U272.10 334.52,61.08 334.01,61.59 334.01,66.67 334.27,66.93 U272.1 | U272.1 | 322.58,64.77 U240.11 | 322.58,64.77 v323.6,64.77 | v335.28,67.94 335.28,67.06 U272.1 | 331.22,68.62 C271.2 | 301.62,59.05 C231.2
  Bottom 0.406: U263.8 296.55,99.69 296.29,99.44 296.29,95.63 296.67,95.25 U211.2 | U211.8 296.55,87.63 296.16,87.25 296.16,83.57 296.55,83.19 U212.2 | 297.94,75.56 U212.8 | U213.8 296.55,63.5 296.16,63.12 296.16,59.44 296.55,59.05 U231.2 | U231.8 296.42,51.44 295.91,50.93 295.91,47.75 296.67,46.99 U232.2 | U232.8 296.42,39.37 296.04,38.99 296.04,35.31 296.42,34.92 U233.2 | U261.2 297.05,22.86 296.29,23.62 296.29,27.05 296.55,27.3 U233.8 | U261.8 299.34,15.24 v299.34,14.1
  Bottom 0.61: U263.2 v299.97,107.31 301.41,107.31 C265.2 | U211.2 300.77,95.25 C211.2 300.99,95.25 301.88,95.25 302.26,95.63 v302.26,97.79 | U212.2 301.41,83.19 C213.2 301.62,83.06 301.5,83.19 302.64,83.19 302.89,83.44 v302.89,85.72 | 301.41,71.12 U213.2 | 301.41,71.12 C215.2 | U231.2 301.41,59.05 C231.2 | U232.2 301.41,46.99 C233.2 | U233.2 301.41,34.92 C235.2 | U261.2 301.41,22.86 C261.2 | C240.2 v324.74,68.45 | C272.2 v341.38,58.93 | v331.22,67.44 331.22,68.62 | 301.62,59.05 302.26,59.05 302.89,59.69 v302.89,61.59 | 301.41,71.12 302.51,71.12 302.89,71.5 v302.89,73.66 300.99,75.56 297.94,75.56
  Bottom 1.27: C233.2 302.98,46.77 v303.02,46.74 | C235.2 302.98,34.71 v303.02,34.67 | C261.2 302.86,22.64 v303.02,22.48
  pour Route2 (isolate 0.254): 261.62,127 261.62,116.2 294.64,116.2 294.64,13.34 309.88,13.34 321.31,24.77 344.81,24.77 344.81,58.42 355.6,58.42 355.6,127
CHWCON  (via drill 0.3 pad 0.51)
  Top 0.254: v328.3,116.2 v316.23,116.2 | U262.3 v323.85,101.6 | v328.3,111.76 J4.44
  Top 0.61: U262.3 296.7,101.6 R405.1
  Bottom 0.254: J1.34 316.23,121.92 v316.23,116.2 | v328.3,116.2 328.3,112.39 v328.3,111.76 328.3,109.86 323.85,105.41 v323.85,101.6
CHWFLAG  (via drill 0.3 pad 0.51)
  Top 0.254: J1.33 317.5,118.11 v322.58,118.11 | U262.5 v321.31,104.14 | v321.31,86.36 J4.24
  Top 0.61: U262.5 295.43,104.14 R407.1
  Bottom 0.254: v322.58,118.11 322.58,111.76 321.31,110.49 v321.31,104.14 v321.31,86.36
CLKSEL
  Bottom 0.254: 288.93,103.5 285.75,103.5 281.94,99.69 281.94,90.17 280.67,88.9 280.67,63.5 279.4,62.23 279.4,55.88 278.76,55.24 278.76,14.61 284.48,8.89 329.56,8.89 330.2,8.26 330.2,4.45 329.56,3.81 J3.31
  Bottom 0.61: U263.12 288.93,103.5 291.31,103.5 R411.2
CMCLK  (via drill 0.3 pad 0.51)
  Top 0.254: v311.15,19.05 316.23,24.13 v333.38,24.13 | v333.38,57.78 342.9,57.78 343.54,58.42 J4.2
  Bottom 0.254: U261.6 309.88,17.78 v311.15,19.05 | J1.47 332.74,72.39 333.38,71.75 v333.38,57.78 v333.38,24.13
  Bottom 0.61: U261.6 296.8,17.78 295.78,16.76 295.43,16.76 R404.1
CMISO  (via drill 0.3 pad 0.51)
  Top 0.254: J1.40 323.85,121.92 323.85,119.38 325.12,118.11 v327.02,118.11 347.98,118.11 J4.48 | v300.36,102.23 v323.21,102.23
  Bottom 0.254: v327.02,118.11 327.02,110.49 323.21,106.68 v323.21,102.23 | U263.6 v300.36,102.23
  Bottom 0.61: U263.6 296.67,102.23 294.89,100.46 R412.1
CMOSI  (via drill 0.3 pad 0.51)
  Top 0.254: v300.36,104.78 v320.68,104.78 | v321.94,114.3 J4.46
  Bottom 0.254: J1.39 321.94,120.02 v321.94,114.3 321.94,113.03 321.94,112.39 320.68,111.12 v320.68,104.78 | U263.4 v300.36,104.78
  Bottom 0.61: U263.4 295.43,104.78 R410.1
CS0_BCK  (via drill 0.3 pad 0.51)
  Top 0.254: v275.59,109.86 v317.5,109.86 318.77,108.58 v328.93,108.58 | 299.97,90.81 v317.5,90.81 | v328.93,104.14 J4.38
  Top 0.61: R413.1 U201.3 299.34,89.53 299.97,90.17 299.97,90.81 299.97,91.31 299.21,92.08 U201.5
  Bottom 0.254: J1.2 275.59,121.92 v275.59,109.86 | v317.5,90.81 v317.5,109.86 | v328.93,108.58 v328.93,104.14
CS0_D0  (via drill 0.3 pad 0.51)
  Top 0.254: v306.07,111.12 v278.13,111.12 | 299.97,78.74 v306.07,78.74 | J4.36 325.75,101.6 325.12,100.97 v306.07,100.97
  Top 0.61: R415.1 U202.3 299.21,77.47 299.97,78.23 299.97,78.74 299.97,79.25 299.21,80.01 U202.5
  Bottom 0.254: J1.4 278.13,121.92 v278.13,111.12 | v306.07,111.12 v306.07,100.97 v306.07,78.74
CS0_D1  (via drill 0.3 pad 0.51)
  Top 0.254: v304.17,110.49 v276.86,110.49 | 297.18,81.28 v304.17,81.28 | J4.35 350.52,100.33 v304.17,100.33
  Top 0.61: 295.4,81.28 R416.1 | 295.4,81.28 297.18,81.28 U202.6 | U202.4 296.29,78.74 295.4,79.63 295.4,81.28
  Bottom 0.254: v276.86,110.49 J1.3 | v304.17,81.28 304.17,99.69 v304.17,100.33 v304.17,110.49
CS0_D2  (via drill 0.3 pad 0.51)
  Top 0.254: v308.61,112.39 v280.67,112.39 | 299.97,66.67 v308.61,66.67 | v308.61,99.06 J4.34
  Top 0.61: R417.1 U203.3 299.47,65.41 299.97,65.91 299.97,66.67 299.97,67.44 299.47,67.94 U203.5
  Bottom 0.254: J1.6 280.67,121.92 v280.67,112.39 | v308.61,66.67 v308.61,99.06 308.61,99.69 v308.61,112.39
CS0_D3  (via drill 0.3 pad 0.51)
  Top 0.254: v306.7,111.76 v279.4,111.76 | 297.18,69.22 v306.7,69.22 | J4.33 350.52,97.79 v306.7,97.79
  Top 0.61: 295.53,69.22 R418.1 | 295.53,69.22 297.18,69.22 U203.6 | U203.4 296.42,66.67 295.4,67.69 295.4,69.09 295.53,69.22
  Bottom 0.254: v279.4,111.76 J1.5 | v306.7,69.22 306.7,97.16 v306.7,97.79 v306.7,111.76
CS0_DIR
  Bottom 0.254: U272.19 329.07,66.28 328.04,67.31 324.1,67.31 322.86,66.07 U240.13
CS0_LRCK  (via drill 0.3 pad 0.51)
  Top 0.254: v274.32,109.22 v303.53,109.22 | v303.53,93.34 U201.6 | J4.37 350.52,105.41 339.73,105.41 338.45,106.68 v303.53,106.68
  Top 0.61: 295.53,93.34 R414.1 | U201.6 295.53,93.34 | U201.4 296.55,90.81 295.53,91.82 295.53,93.34
  Bottom 0.254: v274.32,109.22 J1.1 | v303.53,109.22 v303.53,106.68 303.53,105.41 v303.53,93.34
CS1_BCK  (via drill 0.3 pad 0.51)
  Top 0.254: v285.75,113.67 314.96,113.67 315.6,114.3 v318.13,114.3 | v301.62,92.71 v318.13,92.71 | v318.13,93.98 J4.30
  Bottom 0.254: J1.10 285.75,121.92 v285.75,113.67 | v318.13,92.71 v318.13,93.98 318.13,95.25 v318.13,114.3 | 300.23,92.71 v301.62,92.71
  Bottom 0.61: R419.1 U211.3 299.59,93.98 300.23,93.34 300.23,92.71 300.23,92.08 299.59,91.44 U211.5
CS1_D0  (via drill 0.3 pad 0.51)
  Top 0.254: v304.8,114.94 v288.29,114.94 | J4.28 322.58,91.44 321.94,92.08 v304.8,92.08
  Bottom 0.254: J1.12 288.29,121.92 v288.29,114.94 | v304.8,114.94 v304.8,92.08 304.8,80.64 300.23,80.64
  Bottom 0.61: R421.1 U212.3 299.59,81.92 300.23,81.28 300.23,80.64 300.23,80.14 299.47,79.38 U212.5
CS1_D1  (via drill 0.3 pad 0.51)
  Top 0.254: v305.44,114.3 v287.02,114.3 | J4.27 350.52,90.17 321.31,90.17 320.04,91.44 v305.44,91.44
  Bottom 0.254: v287.02,114.3 J1.11 | v305.44,114.3 v305.44,91.44 305.44,78.11 U212.6
  Bottom 0.61: R422.1 295.4,78.11 | 295.4,78.11 U212.6 | U212.4 296.8,80.64 295.53,79.38 295.53,78.23 295.4,78.11
CS1_D2  (via drill 0.3 pad 0.51)
  Top 0.254: v290.83,116.2 306.07,116.2 v307.34,114.94 | v301.62,68.58 v307.34,68.58 | v307.34,88.9 J4.26
  Bottom 0.254: J1.14 290.83,121.92 v290.83,116.2 | v307.34,68.58 307.34,88.27 v307.34,88.9 v307.34,114.94 | 300.36,68.58 v301.62,68.58
  Bottom 0.61: R423.1 U213.3 299.72,69.85 300.36,69.22 300.36,68.58 300.36,67.94 299.72,67.31 U213.5
CS1_D3  (via drill 0.3 pad 0.51)
  Top 0.254: v289.56,115.57 305.44,115.57 306.7,114.3 v307.98,114.3 | v301.62,66.04 v307.98,66.04 | J4.25 350.52,87.63 v307.98,87.63
  Bottom 0.254: v289.56,115.57 J1.13 | v307.98,66.04 307.98,87 v307.98,87.63 v307.98,114.3 | 297.18,66.04 v301.62,66.04
  Bottom 0.61: R424.1 295.66,66.04 | 295.66,66.04 297.18,66.04 U213.6 | U213.4 296.42,68.58 295.53,67.69 295.53,66.17 295.66,66.04
CS1_DIR
  Bottom 0.254: U272.18 328.96,65.63 327.87,66.72 U240.1
CS1_LRCK  (via drill 0.3 pad 0.51)
  Top 0.254: v319.4,113.03 v284.48,113.03 | v301.62,90.17 v319.4,90.17 | J4.29 350.52,92.71 v319.4,92.71
  Bottom 0.254: v284.48,113.03 J1.9 | v319.4,90.17 v319.4,92.71 319.4,93.34 v319.4,113.03 | 297.18,90.17 v301.62,90.17
  Bottom 0.61: R420.1 295.66,90.17 | 295.66,90.17 297.18,90.17 U211.6 | U211.4 296.55,92.71 295.53,91.69 295.53,90.3 295.66,90.17
CS2_BCK  (via drill 0.3 pad 0.51)
  Top 0.254: v295.91,117.47 307.34,117.47 307.98,116.84 v314.32,116.84 | 300.23,54.61 v314.32,54.61 | v314.32,83.82 J4.22
  Top 0.61: R425.1 U221.3 299.47,53.34 300.23,54.1 300.23,54.61 300.23,55.12 299.47,55.88 U221.5
  Bottom 0.254: J1.18 295.91,121.92 v295.91,117.47 | v314.32,54.61 v314.32,83.82 314.32,84.45 v314.32,116.84
CS2_D0  (via drill 0.3 pad 0.51)
  Top 0.254: v311.79,118.75 v298.45,118.75 | 300.23,41.91 v311.79,41.91 | v311.79,81.28 J4.20
  Top 0.61: R427.1 U222.3 299.59,41.27 300.23,41.91 300.23,43.05 299.47,43.81 U222.5
  Bottom 0.254: J1.20 298.45,121.92 v298.45,118.75 | v311.79,41.91 311.79,80.64 v311.79,81.28 v311.79,118.75
CS2_D1  (via drill 0.3 pad 0.51)
  Top 0.254: v297.18,118.11 307.59,118.11 308.23,117.47 v313.69,117.47 | U222.6 v313.69,45.09 | J4.19 350.52,80.01 v313.69,80.01
  Top 0.61: 295.53,45.09 R428.1 | 295.53,45.09 U222.6 | U222.4 296.67,42.55 295.53,43.69 295.53,45.09
  Bottom 0.254: v297.18,118.11 J1.19 | v313.69,45.09 v313.69,80.01 313.69,80.64 v313.69,117.47
CS2_D2  (via drill 0.3 pad 0.51)
  Top 0.254: v309.25,31.11 301.62,31.11 300.99,30.48 300.1,30.48 | v309.25,78.74 J4.18
  Top 0.61: R429.1 U223.3 299.47,29.21 300.1,29.84 300.1,30.48 300.1,30.99 299.34,31.75 U223.5
  Bottom 0.254: J1.22 300.99,121.92 300.99,119.38 303.53,119.38 307.34,115.57 309.25,115.57 309.25,79.38 v309.25,78.74 v309.25,31.11
CS2_D3  (via drill 0.3 pad 0.51)
  Top 0.254: J1.21 300.99,119.38 v307.98,119.38 | U223.6 v309.88,33.02 | J4.17 350.52,77.47 320.04,77.47 318.77,76.2 v309.88,76.2
  Top 0.61: 295.53,33.02 R430.1 | 295.53,33.02 U223.6 | U223.4 296.29,30.48 295.4,31.37 295.4,32.89 295.53,33.02
  Bottom 0.254: v307.98,119.38 308.61,119.38 309.88,118.11 v309.88,76.2 v309.88,33.02
CS2_DIR
  Bottom 0.254: U272.17 329.48,64.9 328.3,64.9 327.77,65.42 U240.3
CS2_LRCK  (via drill 0.3 pad 0.51)
  Top 0.254: v294.64,116.84 307.09,116.84 308.36,115.57 314.32,115.57 314.96,114.94 v316.23,114.94 | 297.18,57.15 v316.23,57.15 | J4.21 350.52,82.55 320.68,82.55 320.04,81.92 v316.23,81.92
  Top 0.61: 295.53,57.15 R426.1 | 295.53,57.15 297.18,57.15 U221.6 | U221.4 296.55,54.61 295.4,55.75 295.4,57.02 295.53,57.15
  Bottom 0.254: v294.64,116.84 J1.17 | v316.23,57.15 316.23,81.28 v316.23,81.92 v316.23,114.94
CS3_BCK  (via drill 0.3 pad 0.51)
  Top 0.254: J1.26 306.07,121.92 313.06,121.92 313.69,121.28 313.69,118.75 315.6,116.84 v315.6,115.57 | v301.62,56.52 v315.6,56.52 | v315.6,73.66 J4.14
  Bottom 0.254: v315.6,56.52 v315.6,73.66 315.6,74.3 v315.6,115.57 | 300.23,56.52 v301.62,56.52
  Bottom 0.61: R431.1 U231.3 299.47,57.78 300.23,57.02 300.23,56.52 300.23,55.88 299.59,55.24 U231.5
CS3_D0  (via drill 0.3 pad 0.51)
  Top 0.254: v313.06,118.11 v308.61,118.11 | v301.62,43.81 v313.06,43.81 | J4.12 348.62,71.75 v313.06,71.75
  Bottom 0.254: J1.28 306.07,121.92 306.07,120.02 307.98,118.11 v308.61,118.11 | v313.06,43.81 v313.06,71.75 313.06,72.39 v313.06,118.11 | 300.23,43.81 v301.62,43.81
  Bottom 0.61: R433.1 U232.3 299.47,45.72 300.23,44.96 300.23,43.81 299.59,43.18 U232.5
CS3_D1  (via drill 0.3 pad 0.51)
  Top 0.254: J1.27 307.98,120.65 309.25,119.38 v313.06,119.38 | v301.62,42.55 v312.42,42.55 | J4.11 350.52,69.85 343.54,69.85 342.26,71.12 v312.42,71.12
  Bottom 0.254: v313.06,119.38 312.42,118.75 312.42,71.75 v312.42,71.12 v312.42,42.55 | v301.62,42.55 300.36,42.55 299.72,41.91 U232.6
  Bottom 0.61: R434.1 295.4,41.91 | 295.4,41.91 U232.6 | U232.4 296.29,44.45 295.27,43.43 295.27,42.04 295.4,41.91
CS3_D2  (via drill 0.3 pad 0.51)
  Top 0.254: v301.62,32.38 v311.15,32.38 | J4.10 343.54,68.58 342.26,69.85 v311.15,69.85
  Bottom 0.254: J1.30 311.15,121.92 v311.15,69.85 v311.15,32.38 | 300.1,32.38 v301.62,32.38
  Bottom 0.61: R435.1 U233.3 299.47,33.66 300.1,33.02 300.1,32.38 300.1,31.62 299.59,31.11 U233.5
CS3_D3  (via drill 0.3 pad 0.51)
  Top 0.254: v302.26,31.75 v310.51,31.75 | J4.9 350.52,67.31 332.74,67.31 332.11,66.67 330.2,66.67 329.56,67.31 v310.51,67.31
  Bottom 0.254: J1.29 310.51,120.02 v310.51,67.31 v310.51,31.75 | v302.26,31.75 300.36,29.84 U233.6
  Bottom 0.61: U233.6 R436.1 295.27,30.33 295.27,31.5 296.16,32.38 U233.4
CS3_DIR
  Bottom 0.254: U272.16 328.49,64.33 328.3,64.14 327.29,64.14 U240.5
CS3_LRCK  (via drill 0.3 pad 0.51)
  Top 0.254: v314.96,116.2 v309.25,116.2 | v301.62,53.98 v314.96,53.98 | J4.13 350.52,72.39 v314.96,72.39
  Bottom 0.254: J1.25 304.8,119.38 307.98,116.2 v309.25,116.2 | v314.96,53.98 v314.96,72.39 314.96,73.03 v314.96,116.2 | U231.6 v301.62,53.98
  Bottom 0.61: R432.1 295.4,53.98 | 295.4,53.98 U231.6 | U231.4 296.29,56.52 295.4,55.63 295.4,53.98
CSCLK  (via drill 0.3 pad 0.51)
  Top 0.254: v309.25,22.23 316.23,29.21 v339.09,29.21 | v342.9,116.84 v327.66,116.84 | J4.43 350.52,113.03 v342.9,113.03
  Bottom 0.254: U261.3 300.99,21.59 301.62,20.95 307.98,20.95 v309.25,22.23 | v339.09,29.21 339.09,55.24 342.9,59.05 342.9,60.96 | v342.9,116.84 v342.9,113.03 342.9,60.96 | v327.66,116.84 J1.43 | U271.8 342.77,61.09 342.9,60.96
  Bottom 0.61: U261.3 296.8,21.59 295.78,22.61 295.55,22.61 R401.1
CSRCLK  (via drill 0.3 pad 0.51)
  Top 0.254: v310.51,21.59 316.87,27.94 v332.11,27.94 | v331.47,115.57 v321.31,115.57 | v332.11,60.96 J4.4
  Bottom 0.254: U261.4 309.25,20.32 v310.51,21.59 | v332.11,27.94 332.11,59.69 v332.11,60.96 | v332.11,60.96 332.11,65.41 332.74,66.04 332.74,69.85 331.47,71.12 v331.47,115.57 | v321.31,115.57 321.31,121.92 J1.38 | U272.11 331.98,61.08 v332.11,60.96
  Bottom 0.61: U261.4 295.43,20.32 R402.1
CSRCLK2  (via drill 0.3 pad 0.51)
  Top 0.254: v310.51,20.32 v316.87,26.67 | v316.87,113.67 v320.04,113.67 | J4.3 350.52,59.69 v316.87,59.69
  Bottom 0.254: U261.5 309.25,19.05 v310.51,20.32 | v320.04,113.67 J1.37 | v316.87,26.67 316.87,59.05 v316.87,59.69 v316.87,113.67
  Bottom 0.61: U261.5 295.3,19.05 R403.1
D3V3  (via drill 0.51 pad 0.89, 0.81 pad 1.27, 0.89 pad 1.52, 1.27 pad 2.03)
  Top 0.61: v133.48,6.1 v164.85,6.1 | v126.49,68.33 123.44,71.37 v123.44,75.82
  Route15 2.184: J10.7L J10.7R J11.7L J11.7R v123.44,81.28 J12.7L v179.07,81.28 v180.97,81.28 J12.7R J13.7L 232.41,81.28 | 232.41,81.28 J13.7R | 232.41,81.28 v232.41,50.16
  Bottom 0.61: 146.69,47.12 146.81,47.24 C364.1 | C314.+ 167.13,23.11 164.85,20.83 164.85,18.8 | v164.85,6.1 164.85,18.8 | R354.1 160.63,16.87 162.31,18.54 164.59,18.54 164.85,18.8 | v133.48,6.1 124.97,14.61 124.97,26.16 122.81,28.32 119.13,28.32 118.36,29.08 118.36,38.73 119,39.37 122.17,39.37 122.94,40.13 122.94,58.17 123.32,58.55 123.32,65.15 v126.49,68.33 | v123.44,81.28 v123.44,75.82
  other vias: 227.33,50.16 229.87,50.16 226.69,1.91 229.24,1.91 231.78,1.91 238.76,2.54
  pour Bottom: 147.57,48.01 142.75,48.01 142.75,17.27 149.35,17.27 149.35,5.59 150.88,5.59 150.88,27.18 147.32,27.18 147.32,45.97 147.57,45.97
  pour Bottom: 149.35,11.94 149.35,5.59 163.83,5.59 163.83,11.94
  pour Bottom: 149.86,5.71 149.86,0 185.42,0 185.42,13.97 181.61,17.78 181.61,80.01 186.69,80.01 186.69,82.55 178.44,82.55 178.44,62.99 173.99,58.55 173.99,5.08 163.83,5.08 163.83,5.71
  pour Route15: 234.95,48.9 225.43,48.9 225.43,80.64 234.95,80.64
  pour Bottom: 234.95,51.44 225.43,51.44 225.43,0.64 234.95,0.64
  pour Top (isolate 0.254): 225.43,0.64 321.94,0.64 321.94,5.08 250.19,5.08 250.19,3.81 225.43,3.81
D3V3ISO  (via drill 0.51 pad 0.81, 0.89 pad 1.27)
  Top 0.61: 286.77,99.06 285.46,99.06 C264.1 | 286.77,99.06 U262.16 | 286.77,87 285.33,87 C202.1 | 286.77,87 U201.16 | 286.64,74.93 285.33,74.93 C204.1 | 286.64,74.93 U202.16 | 286.64,62.87 285.33,62.87 C206.1 | 286.64,62.87 U203.16 | 286.77,50.8 285.33,50.8 C222.1 | 286.77,50.8 U221.16 | 286.51,38.73 285.33,38.73 C224.1 | 286.51,38.73 U222.16 | 286.51,26.67 285.33,26.67 C226.1 283.68,26.45 v282.19,27.94 | 286.51,26.67 U223.16 | 324.07,19.81 U121.1 | 324.07,19.81 324.07,21.02 C121.1 | R121.2 320.46,18.71 321.56,19.81 324.07,19.81 | v286.77,97.79 286.77,99.06 | v286.64,25.4 286.64,26.54 286.51,26.67 | v286.64,37.47 286.64,38.61 286.51,38.73 | v286.64,49.53 286.64,50.67 286.77,50.8 | v286.77,61.59 286.77,62.74 286.64,62.87 | v286.77,73.79 286.77,74.8 286.64,74.93 | v286.77,85.72 286.77,87 | U262.10 285.12,106.68 284.23,105.79 283.46,105.79 282.7,106.55 282.7,107.7 283.46,108.46 v283.97,108.46
  Top 1.27: v318.9,17.02 R121.2
  Route15 0.61: 283.46,15.24 v284.99,15.24
  Route15 1.27: 314.83,17.02 v318.9,17.02
  Bottom 0.406: U263.10 289.94,100.97 290.58,100.33 290.58,97.54 289.56,96.52